# EasyEDA schematic Home Fusion.json
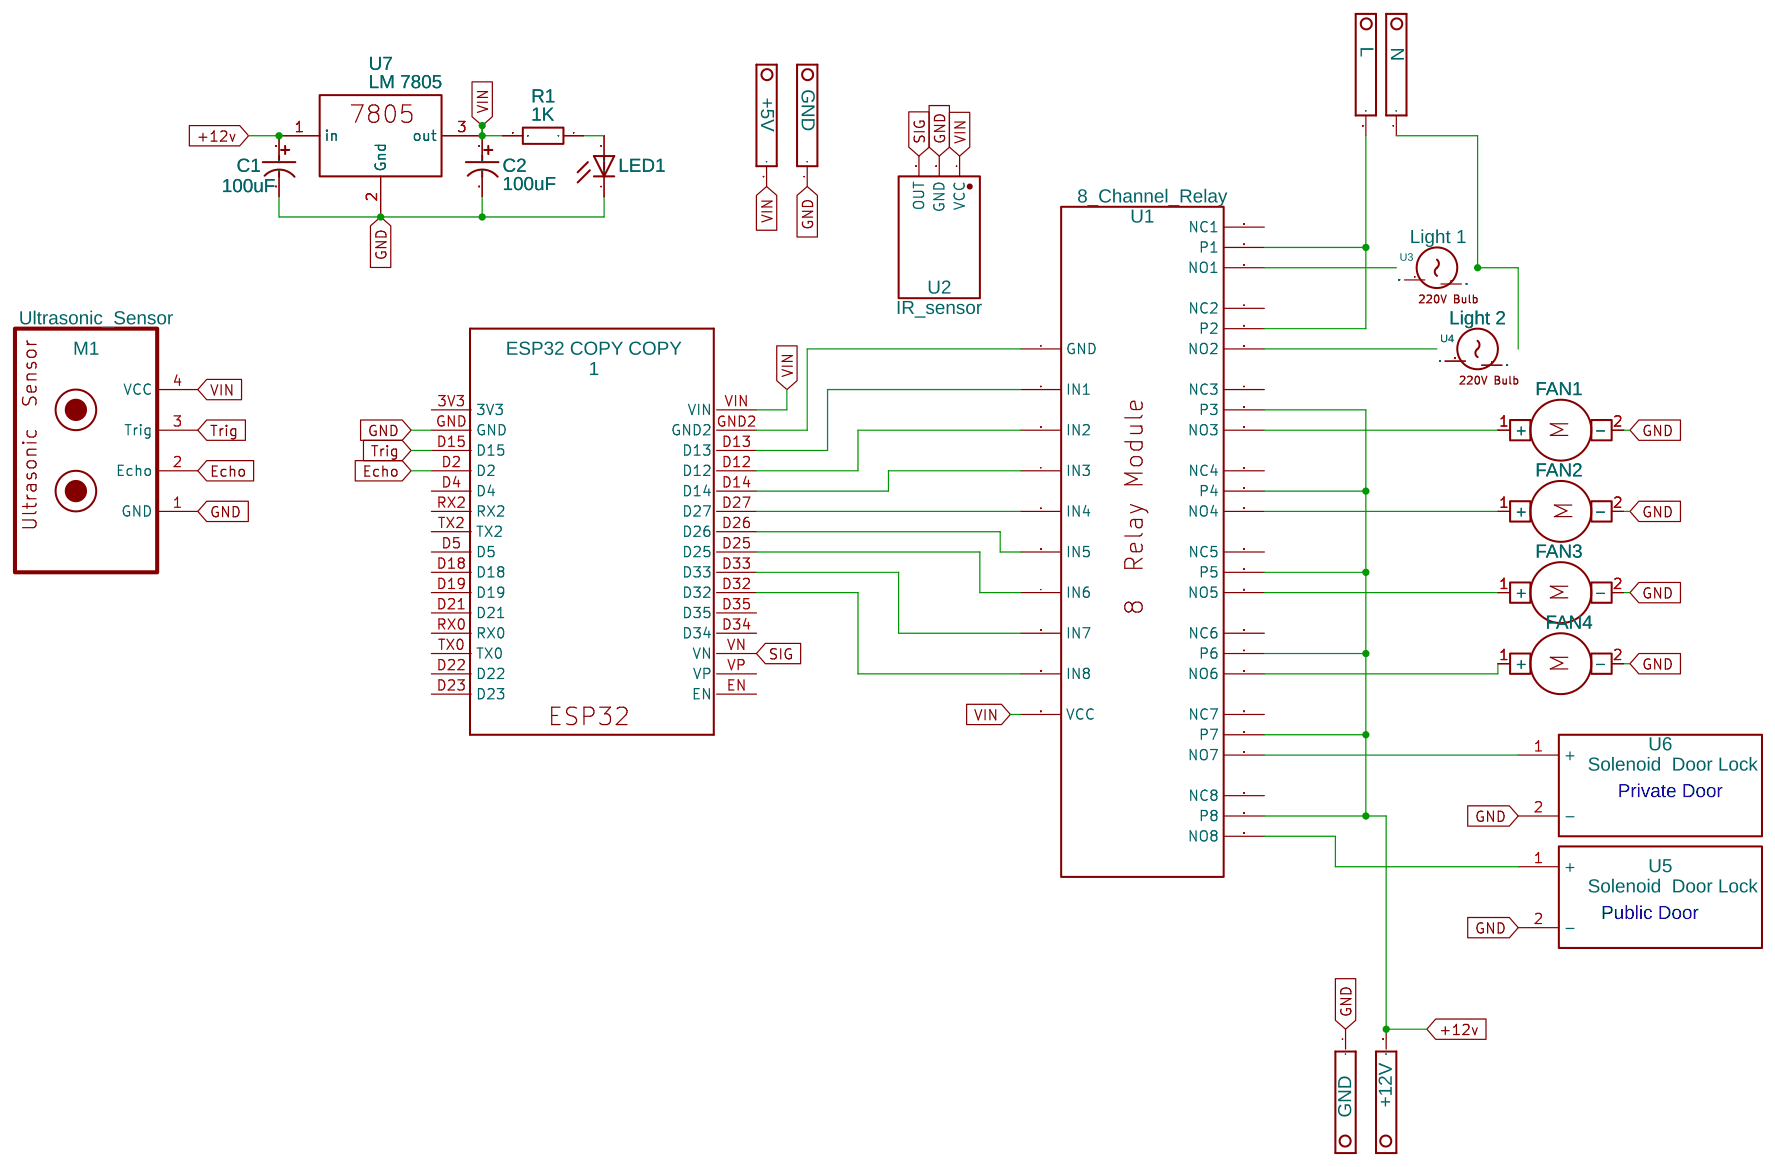
[diagram p0: schematic sheet]

## Parts
1  ESP32 COPY COPY  [ESP32-DEVKITV1_ESP32-DEVKITV1]
+5V  TERMINAL-BLOCK-3.5MM-2-PIN-ROUND-PAD  [TERMINAL-BLOCK-2-PIN-3.5MM-ROUND-PAD]
+12V  TERMINAL-BLOCK-3.5MM-2-PIN-ROUND-PAD  [TERMINAL-BLOCK-2-PIN-3.5MM-ROUND-PAD]
C1  100uF  [100UF16V]
C2  100uF  [100UF16V]
FAN1  12V FAN COPY  [DC FAN]
FAN2  12V FAN COPY  [DC FAN]
FAN3  12V FAN COPY  [DC FAN]
FAN4  12V FAN COPY  [DC FAN]
GND  TERMINAL-BLOCK-3.5MM-2-PIN-ROUND-PAD  [TERMINAL-BLOCK-2-PIN-3.5MM-ROUND-PAD]
GND#2  TERMINAL-BLOCK-3.5MM-2-PIN-ROUND-PAD  [TERMINAL-BLOCK-2-PIN-3.5MM-ROUND-PAD]
L  TERMINAL-BLOCK-3.5MM-2-PIN-ROUND-PAD  [TERMINAL-BLOCK-2-PIN-3.5MM-ROUND-PAD]
LED1  LED_LED5MM COPY2 COPY  [LED_LED5MM]
M1  Ultrasonic_Sensor
N  TERMINAL-BLOCK-3.5MM-2-PIN-ROUND-PAD  [TERMINAL-BLOCK-2-PIN-3.5MM-ROUND-PAD]
R1  1K  [RESISTOR 0.25W]
U1  8_Channel_Relay
U2  IR_sensor
U3  Light 1  [AC CONNECTOR]
U4  Light 2  [AC CONNECTOR]
U5  Solenoid  Door Lock  [DOOR LOCK LY-03]
U6  Solenoid  Door Lock  [DOOR LOCK LY-03]
U7  LM 7805  [LM 7805]

## Library data of the parts
1 = ESP32-DEVKIT-V1-30PIN: Contributor: bensenjero.adviento
+5V +12V GND GND#2 L N = TERMINAL-BLOCK-3.5MM-2-PIN-ROUND-PAD: Contributor: shubham.vaid; subpart_no: 1
C1 C2 = 100UF 16V: Contributor: REMON MECHIL; Supplier: LCSC; Manufacturer: SAMYOUNG(韩国三莹); Manufacturer Part: PXB16V100UF6.3*11; Supplier Part: C150383; JLCPCB Part Class: Extended Part
FAN1-FAN4 = 12V FAN COPY: Contributor: kudgar
LED1 = LED_LED5MM COPY2 COPY: LED
M1 = Ultrasonic_Sensor: sim: true; Manufacturer Part: SEN0307; Supplier: Gravity; Supplier Part: SEN0307; Manufacturer: Gravity; link: N/A; Contributor: karamjot
R1 = RESISTOR 0.25W: Power: 1/4W; Tolerance: ±1%; Contributor: Михаил Сазанов
U1 = 8_Channel_Relay: catid: 20; Contributor: Guest; sim: true
U2 = IR_sensor: catid: 20; Contributor: 20-07540; sim: true
U3 U4 = 220V AC: sim: true; Contributor: Ramit James
U5 U6 = Solenoid  Door Lock: Contributor: s.kitsada91
U7 = LM 7805: Contributor: jhair24cl

## Nets
+12v: +12V.2(K) C1.1 U1.18(P3) U1.21(P4) U1.24(P5) U1.27(P6) U1.30(P7) U1.34(P8) U7.1(in)
GND: 1.GND C1.2 C2.2 FAN1.2(-) FAN2.2(-) FAN3.2(-) FAN4.2(-) GND.1(K) GND#2.1(K) LED1.K(C) M1.1(GND) U2.2(GND) U5.2(-) U6.2(-) U7.2(Gnd)
VIN: 1.VIN +5V.2(K) C2.1 M1.4(VCC) R1.2 U1.10(VCC) U2.1(VCC) U7.3(out)
Echo: 1.D2 M1.2(Echo)
SIG: 1.VN U2.3(OUT)
Trig: 1.D15 M1.3(Trig)
Net-(1-D12): 1.D12 U1.3(IN2)
Net-(1-D13): 1.D13 U1.2(IN1)
Net-(1-D14): 1.D14 U1.4(IN3)
Net-(1-D25): 1.D25 U1.7(IN6)
Net-(1-D26): 1.D26 U1.6(IN5)
Net-(1-D27): 1.D27 U1.5(IN4)
Net-(1-D32): 1.D32 U1.9(IN8)
Net-(1-D33): 1.D33 U1.8(IN7)
Net-(1-GND2): 1.GND2 U1.1(GND)
Net-(FAN1-1): FAN1.1(+) U1.19(NO3)
Net-(FAN2-1): FAN2.1(+) U1.22(NO4)
Net-(FAN3-1): FAN3.1(+) U1.25(NO5)
Net-(FAN4-1): FAN4.1(+) U1.28(NO6)
Net-(L-2): L.2(K) U1.12(P1) U1.15(P2)
Net-(LED1-A): LED1.A R1.1
Net-(N-1): N.1(K) U3.1(PIN1) U4.1(PIN1)
Net-(U1-13): U1.13(NO1) U3.2(PIN2)
Net-(U1-16): U1.16(NO2) U4.2(PIN2)
Net-(U1-29): U1.29(NO8) U5.1(+)
Net-(U1-31): U1.31(NO7) U6.1(+)

Not connected (* = marked no-connect by the designer): 1 3V3 D4 D5 D18 D19 D21 D22 D23 D34 D35 EN RX0 RX2 TX0 TX2 VP; U1 11(NC1) 14(NC2) 17(NC3) 20(NC4) 23(NC5) 26(NC6) 32(NC7) 33(NC8)

## Notes on the sheet
- Private Door
- Public Door
